# Altium schematic sheet Sheet1.SchDoc
size A4
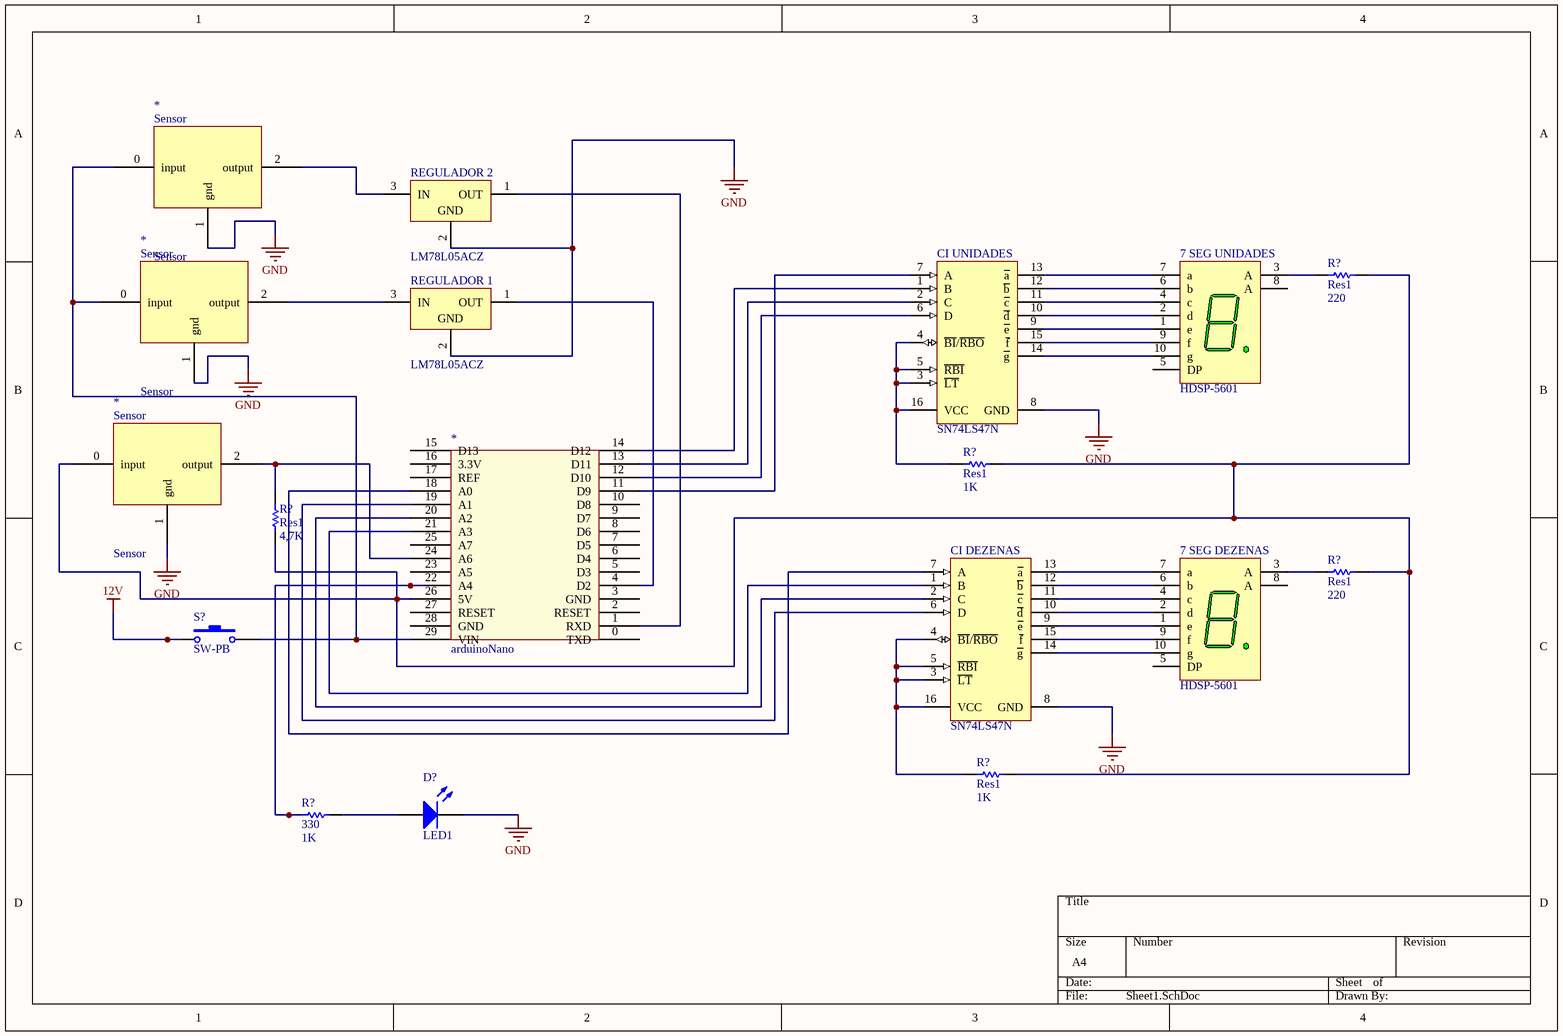
[diagram p0: Sheet1.SchDoc]

## Parts
(Parts that share a designator on the sheet are numbered #1, #2 ... from top to bottom, then left to right.)
7_SEG_DEZENAS  HDSP-5601  [H-10]
7_SEG_UNIDADES  HDSP-5601  [H-10]
*#1  Sensor
*#2  Sensor
*#3  Sensor
*#4  arduinoNano  [Arduino nano]
CI_DEZENAS  SN74LS47N  [TI-N16]
CI_UNIDADES  SN74LS47N  [TI-N16]
D?  LED1  [LED-1]
R?#1  Res1  value 220  [AXIAL-0.3]
R?#2  Res1  value 1K  [AXIAL-0.3]
R?#3  Res1  value 4,7K  [AXIAL-0.3]
R?#4  Res1  value 220  [AXIAL-0.3]
R?#5  Res1  value 1K  [AXIAL-0.3]
R?#6  330  value 1K  [AXIAL-0.3]
REGULADOR_1  LM78L05ACZ  [Z03A]
REGULADOR_2  LM78L05ACZ  [Z03A]
S?  SW-PB  [SPST-2]

## Nets
12V: S?.1
GND: *#1.1(gnd) *#2.1(gnd) *#3.1(gnd) CI_DEZENAS.8(GND) CI_UNIDADES.8(GND) D?.2(K) REGULADOR_1.2(GND) REGULADOR_2.2(GND)
Net7_SEG_DEZENAS_1: 7_SEG_DEZENAS.1(e) CI_DEZENAS.9(~{e})
Net7_SEG_DEZENAS_2: 7_SEG_DEZENAS.2(d) CI_DEZENAS.10(~{d})
Net7_SEG_DEZENAS_3: 7_SEG_DEZENAS.3(A) R?#4.1
Net7_SEG_DEZENAS_4: 7_SEG_DEZENAS.4(c) CI_DEZENAS.11(~{c})
Net7_SEG_DEZENAS_6: 7_SEG_DEZENAS.6(b) CI_DEZENAS.12(~{b})
Net7_SEG_DEZENAS_7: 7_SEG_DEZENAS.7(a) CI_DEZENAS.13(~{a})
Net7_SEG_DEZENAS_9: 7_SEG_DEZENAS.9(f) CI_DEZENAS.15(~{f})
Net7_SEG_DEZENAS_10: 7_SEG_DEZENAS.10(g) CI_DEZENAS.14(~{g})
Net7_SEG_UNIDADES_1: 7_SEG_UNIDADES.1(e) CI_UNIDADES.9(~{e})
Net7_SEG_UNIDADES_2: 7_SEG_UNIDADES.2(d) CI_UNIDADES.10(~{d})
Net7_SEG_UNIDADES_3: 7_SEG_UNIDADES.3(A) R?#1.1
Net7_SEG_UNIDADES_4: 7_SEG_UNIDADES.4(c) CI_UNIDADES.11(~{c})
Net7_SEG_UNIDADES_6: 7_SEG_UNIDADES.6(b) CI_UNIDADES.12(~{b})
Net7_SEG_UNIDADES_7: 7_SEG_UNIDADES.7(a) CI_UNIDADES.13(~{a})
Net7_SEG_UNIDADES_9: 7_SEG_UNIDADES.9(f) CI_UNIDADES.15(~{f})
Net7_SEG_UNIDADES_10: 7_SEG_UNIDADES.10(g) CI_UNIDADES.14(~{g})
Net*#1_0: *#1.0(input) *#2.0(input) *#4.29(VIN) S?.2
Net*#1_2: *#1.2(output) REGULADOR_2.3(IN)
Net*#2_2: *#2.2(output) REGULADOR_1.3(IN)
Net*#3_0: *#3.0(input) *#4.26(5V) R?#1.2 R?#2.2 R?#3.2 R?#4.2 R?#5.2
Net*#3_2: *#3.2(output) *#4.24(A6) R?#3.1
Net*#4_1: *#4.1(RXD) REGULADOR_2.1(OUT)
Net*#4_4: *#4.4(D2) REGULADOR_1.1(OUT)
Net*#4_11: *#4.11(D9) CI_UNIDADES.7(A)
Net*#4_12: *#4.12(D10) CI_UNIDADES.6(D)
Net*#4_13: *#4.13(D11) CI_UNIDADES.2(C)
Net*#4_14: *#4.14(D12) CI_UNIDADES.1(B)
Net*#4_18: *#4.18(A0) CI_DEZENAS.7(A)
Net*#4_19: *#4.19(A1) CI_DEZENAS.6(D)
Net*#4_20: *#4.20(A2) CI_DEZENAS.2(C)
Net*#4_21: *#4.21(A3) CI_DEZENAS.1(B)
Net*#4_22: *#4.22(A4) R?#6.1
NetCI_DEZENAS_3: CI_DEZENAS.3(~{LT}) CI_DEZENAS.4(~{BI}/~{RBO}) CI_DEZENAS.5(~{RBI}) CI_DEZENAS.16(VCC) R?#5.1
NetCI_UNIDADES_3: CI_UNIDADES.3(~{LT}) CI_UNIDADES.4(~{BI}/~{RBO}) CI_UNIDADES.5(~{RBI}) CI_UNIDADES.16(VCC) R?#2.1
NetD?_1: D?.1(A) R?#6.2

Not connected (* = marked no-connect by the designer): 7_SEG_DEZENAS 5(DP) 8(A); 7_SEG_UNIDADES 5(DP) 8(A); *#4 0(TXD) 2(RESET) 3(GND) 5(D3) 6(D4) 7(D5) 8(D6) 9(D7) 10(D8) 15(D13) 16(3.3V) 17(REF) 23(A5) 25(A7) 27(RESET) 28(GND)

## Library data of the parts
7_SEG_DEZENAS 7_SEG_UNIDADES = HDSP-5601: 14.22 mm Gray Surface Green 7-Segment Display: CA, RH DP; Note: Pins 3 and 8 are redundant Anodes.; Published: 26-May-2004; LatestRevisionDate: 11-Oct-2004; LatestRevisionNote: Display outline superimposed on PCB Footprint.; DatasheetVersion: 17-Jan-2002; PackageVersion: 11-Mar-2003; PackageReference: H-10; Publisher: Altium Limited; PackageDescription: LED, 7-Segment Display, 14.22 mm, RHD; 10 Leads; Row Space 15.24 mm; Pitch 2.54 mm; ComponentLink1Description: Manufacturer Link; ComponentLink1URL: http://www.avagotech.com/; ComponentLink2Description: Datasheet; ComponentLink2URL: http://cp.literature.agilent.com/litweb/pdf/5988-4273EN.pdf
CI_DEZENAS CI_UNIDADES = SN74LS47N: BCD-to-7-Segment Decoder / Driver, 4.75 to 5.25 V, 0 to 70 degC, 16-pin DIP (N16), Pb-Free (RoHS); Manufacturer: Texas Instruments; Rating: Catalog; SubFamily: Discrete Segment LED Driver; Vin(Max)(V): 5.25; Vin(Min)(V): 4.75; DatasheetVersion: SDLS111; PackageVersion: 4040049/E; PackageReference: N16; PackageDescription: 16-Pin Plastic In-Line, Body 19.305 x 6.35 mm, Pitch 2.54 mm; Supplier 1: Digi-Key; Supplier Part Number 1: 296-3712-5-ND; Supplier 2: Farnell; Supplier Part Number 2: 1739829; Supplier 3: Newark; Supplier Part Number 3: 60K6887; Supplier 4: Mouser; Supplier Part Number 4: 595-SN74LS47N; Eco-Plan: Pb-Free (RoHS); Mounting Technology: Through Hole; Code_JEDEC: MS-001; PartNumber: SN74LS47N; ComponentLink1Description: Manufacturer URL; ComponentLink1URL: http://www.ti.com/; ComponentLink2Description: Datasheet; ComponentLink2URL: http://www.ti.com/general/docs/lit/getliterature.tsp?genericPartNumber=SN74LS47&fileType=pdf; ComponentLink3Description: Package Specification; ComponentLink3URL: http://www.ti.com/litv/pdf/mpdi002c
D? = LED1: Typical RED GaAs LED; Published: 8-Jun-2000; LatestRevisionDate: 08-Jul-2005; LatestRevisionNote: Mech Layer 1 removed.; PackageReference: LED-1; Publisher: Altium Limited; PackageDescription: LED; 2 Leads
R?#1-R?#6 = Res1: Resistor; Published: 8-Jun-2000; LatestRevisionDate: 17-Jul-2002; LatestRevisionNote: Re-released for DXP Platform.; PackageReference: AXIAL-0.3; Publisher: Altium Limited; PackageDescription: Axial Device, Thru-Hole; 2 Leads; 0.3 in Pin Spacing
REGULADOR_1 REGULADOR_2 = LM78L05ACZ: 3-Terminal Positive Regulators, 3-pin TO-92; Manufacturer: National Semiconductor; PackageTopMarking: NSXYTT*LM78L*05ACZ; PowerWise: N; CompType: LDO IC; High-Reliability: Y; DatasheetVersion: Apr-2006; PackageVersion: revG, Sep-2000; PackageReference: Z03A; PackageDescription: TO-92, Molded, 3 Lead; PartNumber: LM78L05ACZ; RoHS: N; PinCount: 3; Code_JEDEC: TO-226-AA; ComponentLink1Description: Manufacturer URL; ComponentLink1URL: http://www.national.com/; ComponentLink2Description: LM78L05 Datasheet; ComponentLink2URL: http://www.national.com/ds/LM/LM78L05.pdf; ComponentLink3Description: LM78L05 Web Page; ComponentLink3URL: http://www.national.com/pf/LM/LM78L05.html; ComponentLink4Description: Z03A Package Page; ComponentLink4URL: http://www.national.com/packaging/folders/z03a.html
S? = SW-PB: Switch; Published: 24-Mar-1999; LatestRevisionDate: 17-Jul-2002; LatestRevisionNote: Re-released for DXP Platform.; PackageReference: SPST-2; Publisher: Altium Limited; PackageDescription: Switch; 2 Leads